# Altium schematic sheet PROJECT.SchDoc
size A4; SheetNumber: 1; SheetTotal: 13
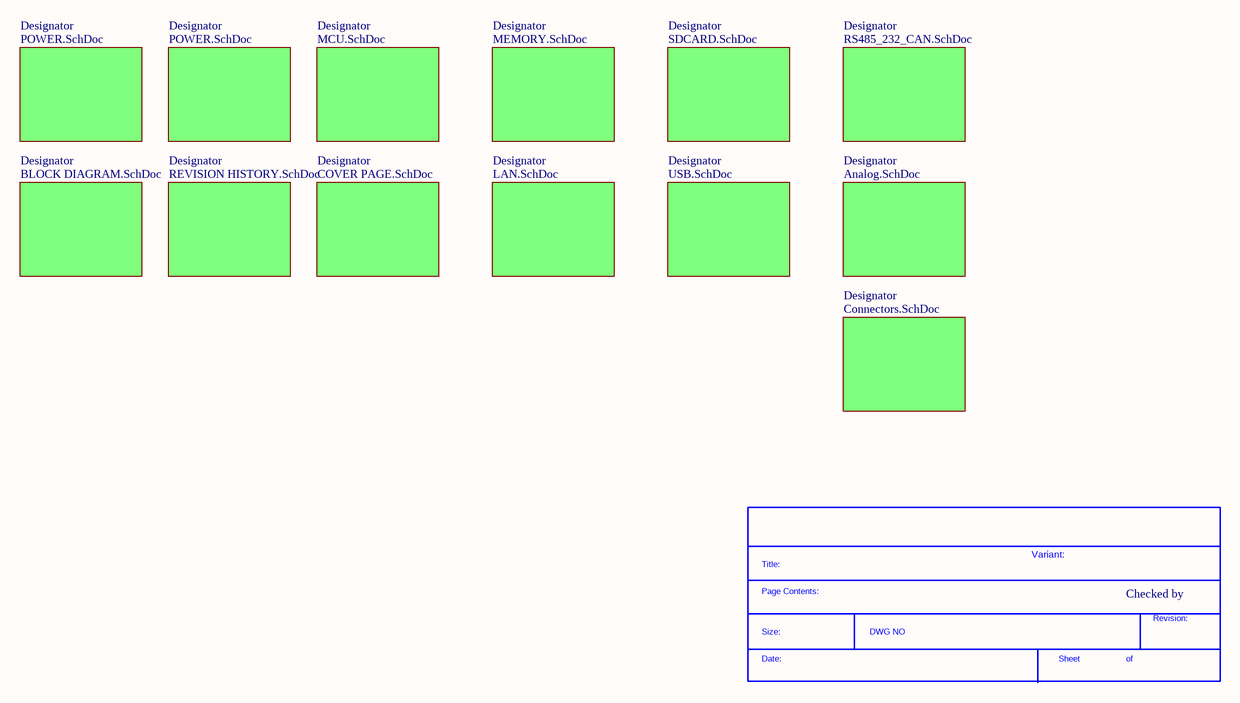
[diagram p0: PROJECT.SchDoc]

## Parts
*?  SDTitleBlock  (value not drawn)  (graphical)

## Sub-sheets
Designator = MCU.SchDoc: no entries
Designator = POWER.SchDoc: no entries
Designator = POWER.SchDoc: no entries
Designator = BLOCK DIAGRAM.SchDoc: no entries
Designator = REVISION HISTORY.SchDoc: no entries
Designator = MEMORY.SchDoc: no entries
Designator = COVER PAGE.SchDoc: no entries
Designator = LAN.SchDoc: no entries
Designator = SDCARD.SchDoc: no entries
Designator = USB.SchDoc: no entries
Designator = RS485_232_CAN.SchDoc: no entries
Designator = Analog.SchDoc: no entries
Designator = Connectors.SchDoc: no entries

## Notes on the sheet
- Variant:
- Checked by
- (in symbol SDTitleBlock) Title:; Page Contents:; Revision:; Size:; DWG NO; Date:; Sheet; of